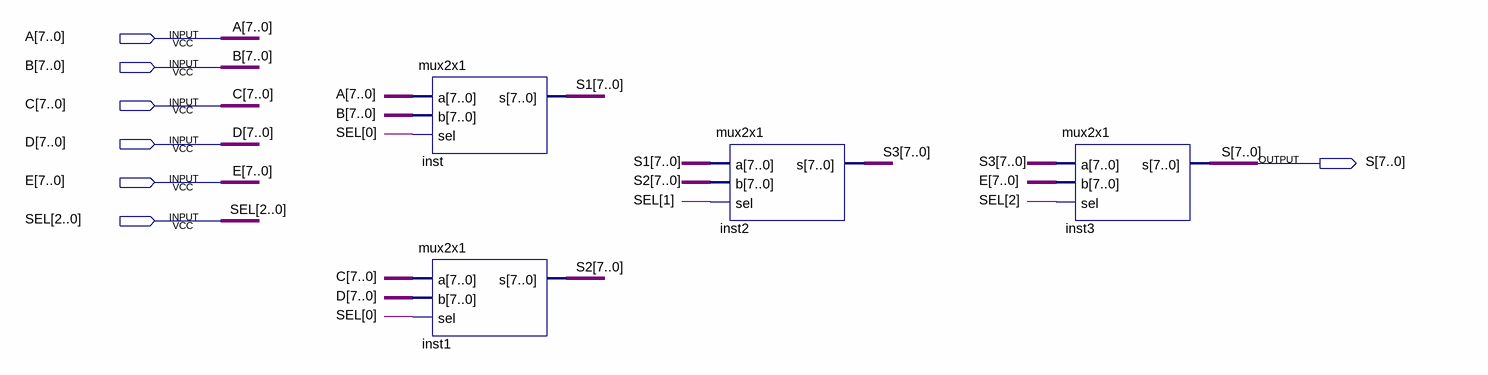
[diagram p0: schematic sheet]
// Quartus schematic mux5x1.bdf as structural Verilog: 4 symbols, 7 pins
module mux5x1 (
  input  [7:0] A,
  input  [7:0] B,
  input  [7:0] C,
  input  [7:0] D,
  input  [7:0] E,
  input  [2:0] SEL,
  output [7:0] S
);

  wire [7:0] S1, S2, S3;

  mux2x1 inst (.a(A), .b(B), .sel(SEL[0]), .s(S1));
  mux2x1 inst1 (.a(C), .b(D), .sel(SEL[0]), .s(S2));
  mux2x1 inst2 (.a(S1), .b(S2), .sel(SEL[1]), .s(S3));
  mux2x1 inst3 (.a(S3), .b(E), .sel(SEL[2]), .s(S));
endmodule
